# EAGLE schematic HVAC8V2 (EAGLE 7.5.0)
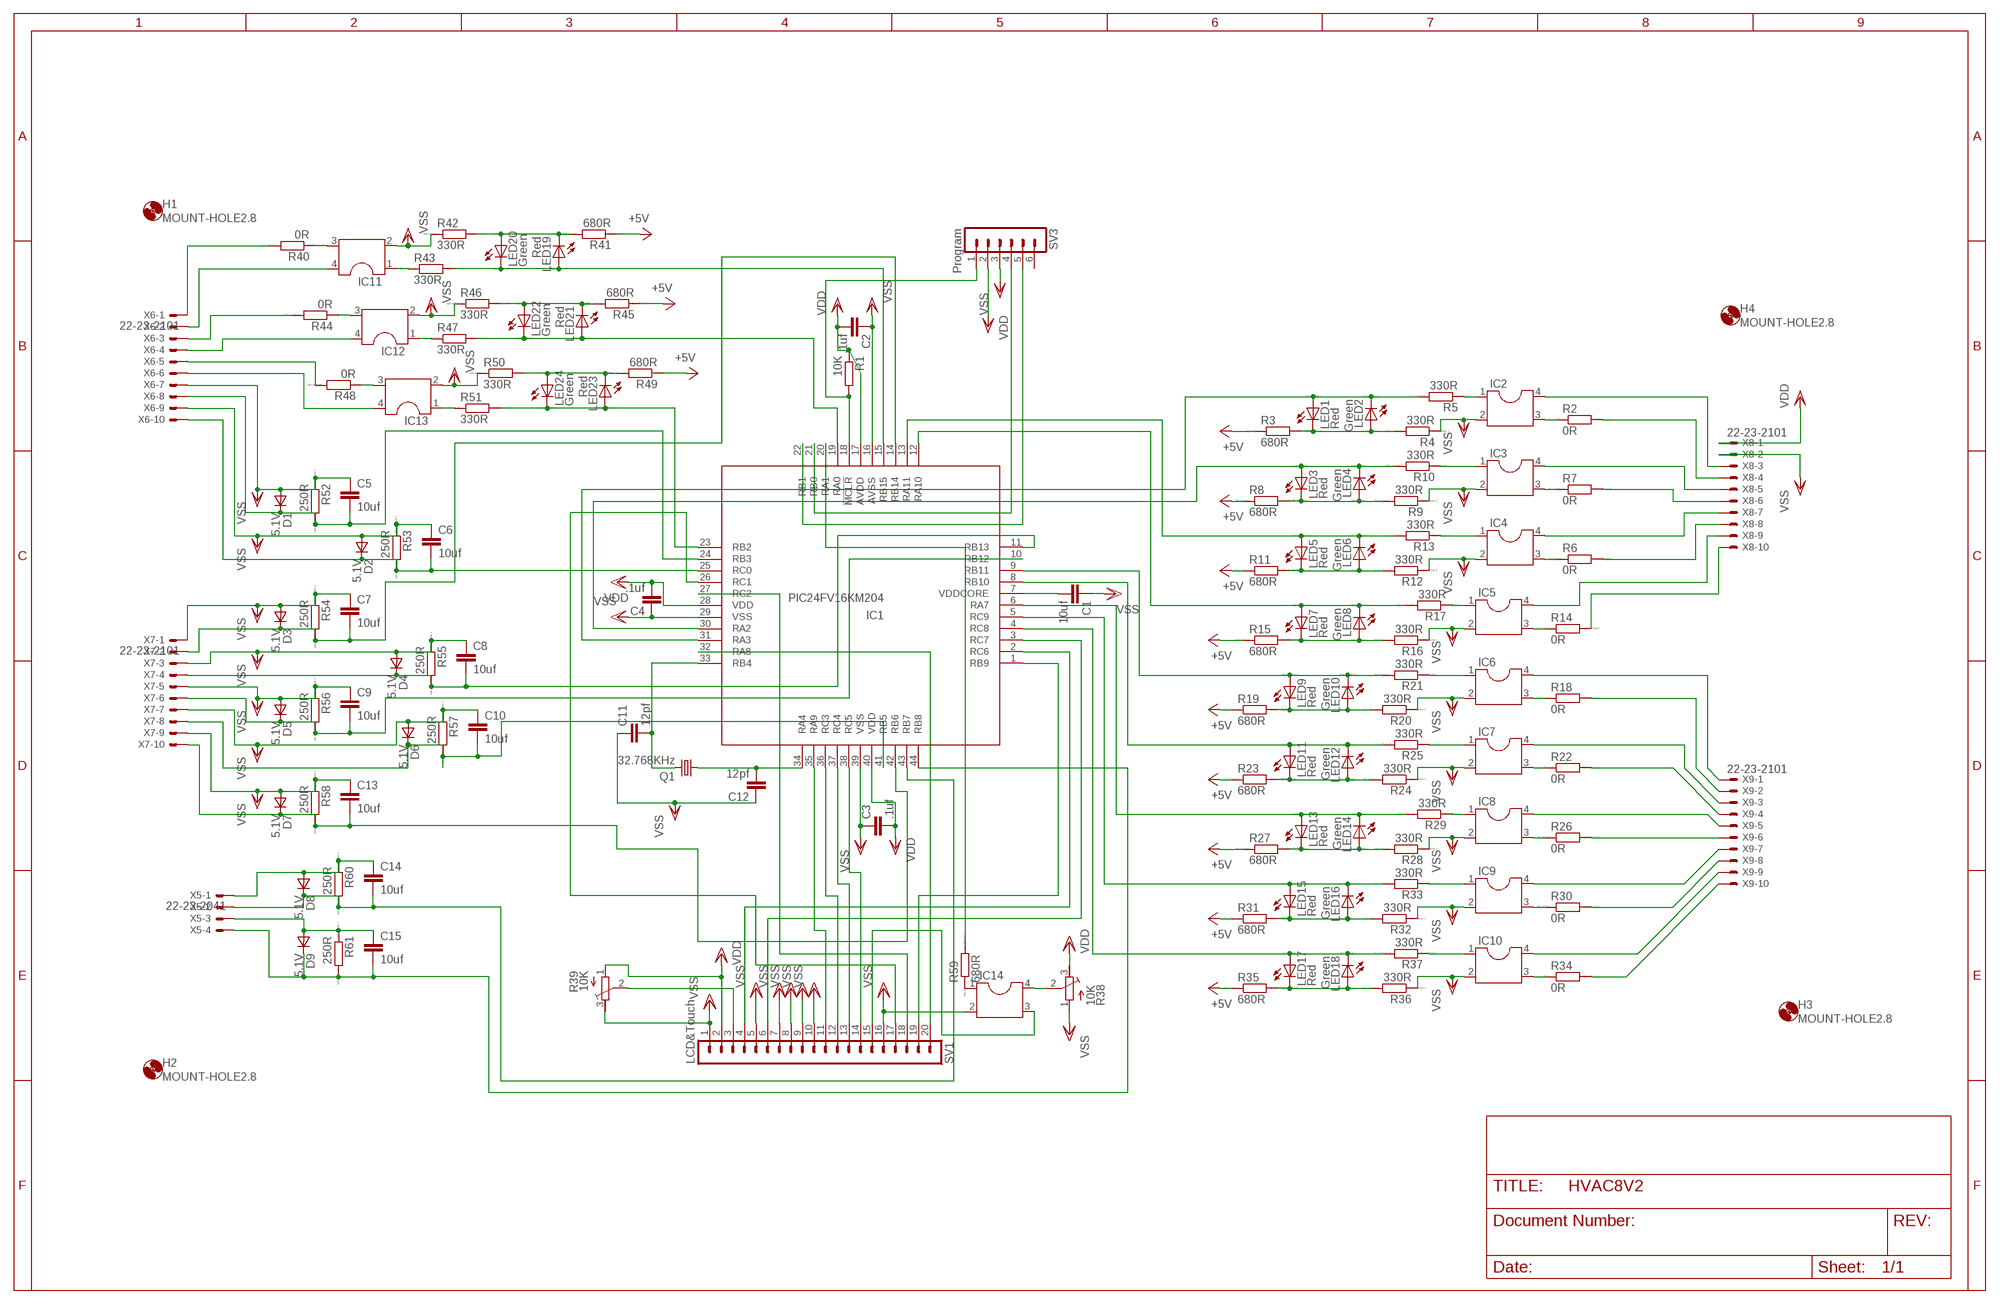
[diagram p0: schematic, sheet 1]

## Parts
C1  10uf  C-EUC1206  [C1206]
C2  .1uf  C-EUC1206  [C1206]
C3  .1uf  C-EUC1206  [C1206]
C4  .1uf  C-EUC1206  [C1206]
C5  10uf  C-EUC1206  [C1206]
C6  10uf  C-EUC1206  [C1206]
C7  10uf  C-EUC1206  [C1206]
C8  10uf  C-EUC1206  [C1206]
C9  10uf  C-EUC1206  [C1206]
C10  10uf  C-EUC1206  [C1206]
C11  12pf  C-EUC0603  [C0603]
C12  12pf  C-EUC0603  [C0603]
C13  10uf  C-EUC1206  [C1206]
C14  10uf  C-EUC1206  [C1206]
C15  10uf  C-EUC1206  [C1206]
D1  5.1V  DSOD323  [SOD323]
D2  5.1V  DSOD323  [SOD323]
D3  5.1V  DSOD323  [SOD323]
D4  5.1V  DSOD323  [SOD323]
D5  5.1V  DSOD323  [SOD323]
D6  5.1V  DSOD323  [SOD323]
D7  5.1V  DSOD323  [SOD323]
D8  5.1V  DSOD323  [SOD323]
D9  5.1V  DSOD323  [SOD323]
H1  MOUNT-HOLE2.8  [2,8]
H2  MOUNT-HOLE2.8  [2,8]
H3  MOUNT-HOLE2.8  [2,8]
H4  MOUNT-HOLE2.8  [2,8]
IC1  PIC24FV16KM204  [TQFP44]
IC2  DIL4S  [SOCKET-04]
IC3  DIL4S  [SOCKET-04]
IC4  DIL4S  [SOCKET-04]
IC5  DIL4S  [SOCKET-04]
IC6  DIL4S  [SOCKET-04]
IC7  DIL4S  [SOCKET-04]
IC8  DIL4S  [SOCKET-04]
IC9  DIL4S  [SOCKET-04]
IC10  DIL4S  [SOCKET-04]
IC11  DIL4S  [SOCKET-04]
IC12  DIL4S  [SOCKET-04]
IC13  DIL4S  [SOCKET-04]
IC14  DIL4S  [SOCKET-04]
LED1  Red  LED_E  [LED_1206]
LED2  Green  LED_E  [LED_1206]
LED3  Red  LED_E  [LED_1206]
LED4  Green  LED_E  [LED_1206]
LED5  Red  LED_E  [LED_1206]
LED6  Green  LED_E  [LED_1206]
LED7  Red  LED_E  [LED_1206]
LED8  Green  LED_E  [LED_1206]
LED9  Red  LED_E  [LED_1206]
LED10  Green  LED_E  [LED_1206]
LED11  Red  LED_E  [LED_1206]
LED12  Green  LED_E  [LED_1206]
LED13  Red  LED_E  [LED_1206]
LED14  Green  LED_E  [LED_1206]
LED15  Red  LED_E  [LED_1206]
LED16  Green  LED_E  [LED_1206]
LED17  Red  LED_E  [LED_1206]
LED18  Green  LED_E  [LED_1206]
LED19  Red  LED_E  [LED_1206]
LED20  Green  LED_E  [LED_1206]
LED21  Red  LED_E  [LED_1206]
LED22  Green  LED_E  [LED_1206]
LED23  Red  LED_E  [LED_1206]
LED24  Green  LED_E  [LED_1206]
Q1  32.768KHz  CRYSTALTC26H  [TC26H]
R1  10K  R-EU_R1206  [R1206]
R2  0R  RR1206  [R1206]
R3  680R  RR1206  [R1206]
R4  330R  RR1206  [R1206]
R5  330R  RR1206  [R1206]
R6  0R  RR1206  [R1206]
R7  0R  RR1206  [R1206]
R8  680R  RR1206  [R1206]
R9  330R  RR1206  [R1206]
R10  330R  RR1206  [R1206]
R11  680R  RR1206  [R1206]
R12  330R  RR1206  [R1206]
R13  330R  RR1206  [R1206]
R14  0R  RR1206  [R1206]
R15  680R  RR1206  [R1206]
R16  330R  RR1206  [R1206]
R17  330R  RR1206  [R1206]
R18  0R  RR1206  [R1206]
R19  680R  RR1206  [R1206]
R20  330R  RR1206  [R1206]
R21  330R  RR1206  [R1206]
R22  0R  RR1206  [R1206]
R23  680R  RR1206  [R1206]
R24  330R  RR1206  [R1206]
R25  330R  RR1206  [R1206]
R26  0R  RR1206  [R1206]
R27  680R  RR1206  [R1206]
R28  330R  RR1206  [R1206]
R29  330R  RR1206  [R1206]
R30  0R  RR1206  [R1206]
R31  680R  RR1206  [R1206]
R32  330R  RR1206  [R1206]
R33  330R  RR1206  [R1206]
R34  0R  RR1206  [R1206]
R35  680R  RR1206  [R1206]
R36  330R  RR1206  [R1206]
R37  330R  RR1206  [R1206]
R38  10K  R-TRIMM3296W  [RTRIM3296W]
R39  10K  R-TRIMM3296W  [RTRIM3296W]
R40  0R  RR1206  [R1206]
R41  680R  RR1206  [R1206]
R42  330R  RR1206  [R1206]
R43  330R  RR1206  [R1206]
R44  0R  RR1206  [R1206]
R45  680R  RR1206  [R1206]
R46  330R  RR1206  [R1206]
R47  330R  RR1206  [R1206]
R48  0R  RR1206  [R1206]
R49  680R  RR1206  [R1206]
R50  330R  RR1206  [R1206]
R51  330R  RR1206  [R1206]
R52  250R  RR1206  [R1206]
R53  250R  RR1206  [R1206]
R54  250R  RR1206  [R1206]
R55  250R  RR1206  [R1206]
R56  250R  RR1206  [R1206]
R57  250R  RR1206  [R1206]
R58  250R  RR1206  [R1206]
R59  680R  RR1206  [R1206]
R60  250R  RR1206  [R1206]
R61  250R  RR1206  [R1206]
SV1  LCD&Touch  MA20-1  [MA20-1]
SV3  Program  MA06-1  [MA06-1]
X5  22-23-2041  [22-23-2041]
X6  22-23-2101  [22-23-2101]
X7  22-23-2101  [22-23-2101]
X8  22-23-2101  [22-23-2101]
X9  22-23-2101  [22-23-2101]

## Nets
+5V: R3.1 R8.1 R11.1 R15.1 R19.1 R23.1 R27.1 R31.1 R35.1 R41.1 R45.1 R49.1
N$1: IC13.1 R51.1
N$2: IC1.18(!MCLR) R1.2 SV3.1
N$3: IC2.1 R5.1
N$4: IC1.12(RA10) LED7.A LED8.C R17.2
N$5: IC2.4 X8.3
N$6: LED1.C LED2.A R3.2 R4.2
N$7: IC2.3 R2.1
N$8: IC3.1 R10.1
N$9: R2.2 X8.4
N$10: IC3.4 X8.5
N$11: LED3.C LED4.A R8.2 R9.2
N$12: IC3.3 R7.1
N$13: IC11.1 R43.1
N$14: R7.2 X8.6
N$15: IC4.1 R13.1
N$16: LED5.C LED6.A R11.2 R12.2
N$17: IC4.3 R6.1
N$18: LED19.C LED20.A R41.2 R42.2
N$19: R14.2 X8.10
N$20: IC5.4 X8.9
N$21: IC5.1 R17.1
N$22: LED7.C LED8.A R15.2 R16.2
N$23: IC5.3 R14.1
N$24: IC6.1 R21.1
N$25: LED9.C LED10.A R19.2 R20.2
N$26: IC6.3 R18.1
N$27: R6.2 X8.8
N$28: IC4.4 X8.7
N$29: IC11.3 R40.1
N$30: IC6.4 X9.1
N$31: R18.2 X9.2
N$32: IC12.1 R47.1
N$33: IC7.1 R25.1
N$34: LED11.C LED12.A R23.2 R24.2
N$35: IC7.3 R22.1
N$36: IC1.9(RB11) LED9.A LED10.C R21.2
N$37: IC7.4 X9.3
N$38: R22.2 X9.4
N$39: IC8.1 R29.1
N$40: LED13.C LED14.A R27.2 R28.2
N$41: IC8.3 R26.1
N$42: IC9.1 R33.1
N$43: LED15.C LED16.A R31.2 R32.2
N$44: IC9.3 R30.1
N$45: IC1.5(RC9) LED15.A LED16.C R33.2
N$46: IC1.15(RB15) LED19.A LED20.C R43.2
N$47: IC10.1 R37.1
N$48: LED17.C LED18.A R35.2 R36.2
N$49: IC10.3 R34.1
N$50: IC1.4(RC8) LED17.A LED18.C R37.2
N$51: IC8.4 X9.5
N$52: R26.2 X9.6
N$53: IC9.4 X9.7
N$54: R30.2 X9.8
N$55: IC10.4 X9.9
N$56: R34.2 X9.10
N$57: LED21.C LED22.A R45.2 R46.2
N$58: IC12.3 R44.1
N$59: IC1.19(RA0) LED21.A LED22.C R47.2
N$60: R40.2 X6.1
N$61: IC1.6(RA7) LED13.A LED14.C R29.2
N$62: IC11.4 X6.2
N$63: R39.2(S) SV1.3
N$64: R44.2 X6.3
N$65: IC12.4 X6.4
N$66: IC1.3(RC7) SV1.6
N$67: IC1.8(RB10) LED11.A LED12.C R25.2
N$68: IC1.2(RC6) SV1.4
N$69: IC1.31(RA3) LED1.A LED2.C R5.2
N$70: IC1.13(RA11) LED5.A LED6.C R13.2
N$71: IC1.30(RA2) LED3.A LED4.C R10.2
N$72: IC1.35(RA9) SV1.11
N$73: IC1.36(RC3) SV1.12
N$74: IC1.37(RC4) SV1.13
N$75: IC1.38(RC5) SV1.14
N$76: IC14.3 SV1.15
N$77: LED23.C LED24.A R49.2 R50.2
N$78: IC13.3 R48.1
N$79: IC1.23(RB2) LED23.A LED24.C R51.2
N$80: R48.2 X6.5
N$81: IC13.4 X6.6
N$82: IC14.4 R38.2(S)
N$83: C5.2 D1.1(C) IC1.24(RB3) R52.2 X6.8
N$84: IC1.26(RC1) SV1.17
N$85: C6.2 D2.1(C) IC1.25(RC0) R53.2 X6.10
N$86: IC1.27(RC2) SV1.18
N$87: C7.2 D3.1(C) IC1.14(RB14) R54.2 X7.2
N$88: IC1.1(RB9) SV1.19
N$89: C8.2 D4.1(C) IC1.11(RB13) R55.2 X7.4
N$90: IC1.32(RA8) SV1.20
N$91: IC1.22(RB1) SV3.5
N$92: C9.2 D5.1(C) IC1.10(RB12) R56.2 X7.6
N$93: C10.2 D6.1(C) IC1.41(RB5) R57.2 X7.8
N$94: IC1.21(RB0) SV3.4
N$95: C12.2 IC1.34(RA4) Q1.1
N$96: C11.2 IC1.33(RB4) Q1.2
N$97: C13.2 D7.1(C) IC1.42(RB6) R58.2 X7.10
N$98: IC14.1 R59.1
N$99: IC1.20(RA1) R59.2
N$100: C14.1 D8.2(A) R60.1 X5.1
N$101: C14.2 D8.1(C) IC1.43(RB7) R60.2 X5.2
N$102: C15.1 D9.2(A) R61.1 X5.3
N$103: C15.2 D9.1(C) IC1.44(RB8) R61.2 X5.4
VDD: C2.2 C3.2 C4.2 IC1.17(AVDD) IC1.28(VDD) IC1.40(VDD) R1.1 R38.3(E) R39.1(A) SV1.2 SV3.2 X8.1
VDDCORENET: C1.2 IC1.7(VDDCORE)
VSS: C1.1 C2.1 C3.1 C4.1 C5.1 C6.1 C7.1 C8.1 C9.1 C10.1 C11.1 C12.1 C13.1 D1.2(A) D2.2(A) D3.2(A) D4.2(A) D5.2(A) D6.2(A) D7.2(A) IC1.16(AVSS) IC1.29(VSS) IC1.39(VSS) IC2.2 IC3.2 IC4.2 IC5.2 IC6.2 IC7.2 IC8.2 IC9.2 IC10.2 IC11.2 IC12.2 IC13.2 IC14.2 R4.1 R9.1 R12.1 R16.1 R20.1 R24.1 R28.1 R32.1 R36.1 R38.1(A) R39.3(E) R42.1 R46.1 R50.1 R52.1 R53.1 R54.1 R55.1 R56.1 R57.1 R58.1 SV1.1 SV1.5 SV1.7 SV1.8 SV1.9 SV1.10 SV1.16 SV3.3 X6.7 X6.9 X7.1 X7.3 X7.5 X7.7 X7.9 X8.2
Unconnected: SV3.6

## Library data of the parts
C1-C15 = rcl:C-EU: CAPACITOR, European symbol
D1-D9 = zetex:D: DIODE; MPN: CDSOD323-T05C; OC_FARNELL: 1824860; OC_NEWARK: 79R6078
H1-H4 = holes:MOUNT-HOLE: MOUNTING HOLE with drill center marker
IC1 = microchip:PIC24FV16KM204: PIC24FV16KM204 TQFP-44 Auto generated by make-symbol-device-package-bsdl.ulp Rev. 25 Edited by Dave Source: PIC24FJ64GA004.bsd; MPN: PIC24FV16KM204; OC_FARNELL: 1332299; OC_NEWARK: 98M1927
IC2-IC14 = ic-package:DIL4: Dual In Line / Socket
LED1-LED24 = eagle-ltspice:LED_E: LED Source: http://www.osram.convergy.de Source: www.luxeon.com Source: www.kingbright.com; SPICEMODEL: NONE; SPICEPREFIX: D; SPICETYPE: diode
Q1 = crystal:CRYSTAL: CRYSTAL; OC_FARNELL: unknown; OC_NEWARK: unknown
R1 = rcl:R-EU_: RESISTOR, European symbol
R2-R37 R40-R61 = eagle-ltspice:R: RESISTOR, European symbol; SPICEMODEL: NONE; SPICEPREFIX: R
R38 R39 = rcl:R-TRIMM: Trimm resistor
SV1 = con-lstb:MA20-1: PIN HEADER; OC_FARNELL: unknown; OC_NEWARK: unknown
SV3 = con-lstb:MA06-1: PIN HEADER; OC_FARNELL: unknown; OC_NEWARK: unknown
X5 = con-molex:22-23-2041: .100" (2.54mm) Center Header - 4 Pin; MF: MOLEX; MPN: 22-23-2041; OC_FARNELL: 1462920; OC_NEWARK: 38C0355
X6-X9 = con-molex:22-23-2101: .100" (2.54mm) Center Header - 10 Pin; MF: MOLEX; MPN: 22-23-2101; OC_FARNELL: 1756828; OC_NEWARK: 94C0765